# Altium schematic sheet STM32F405RGT6.SchDoc
size A4
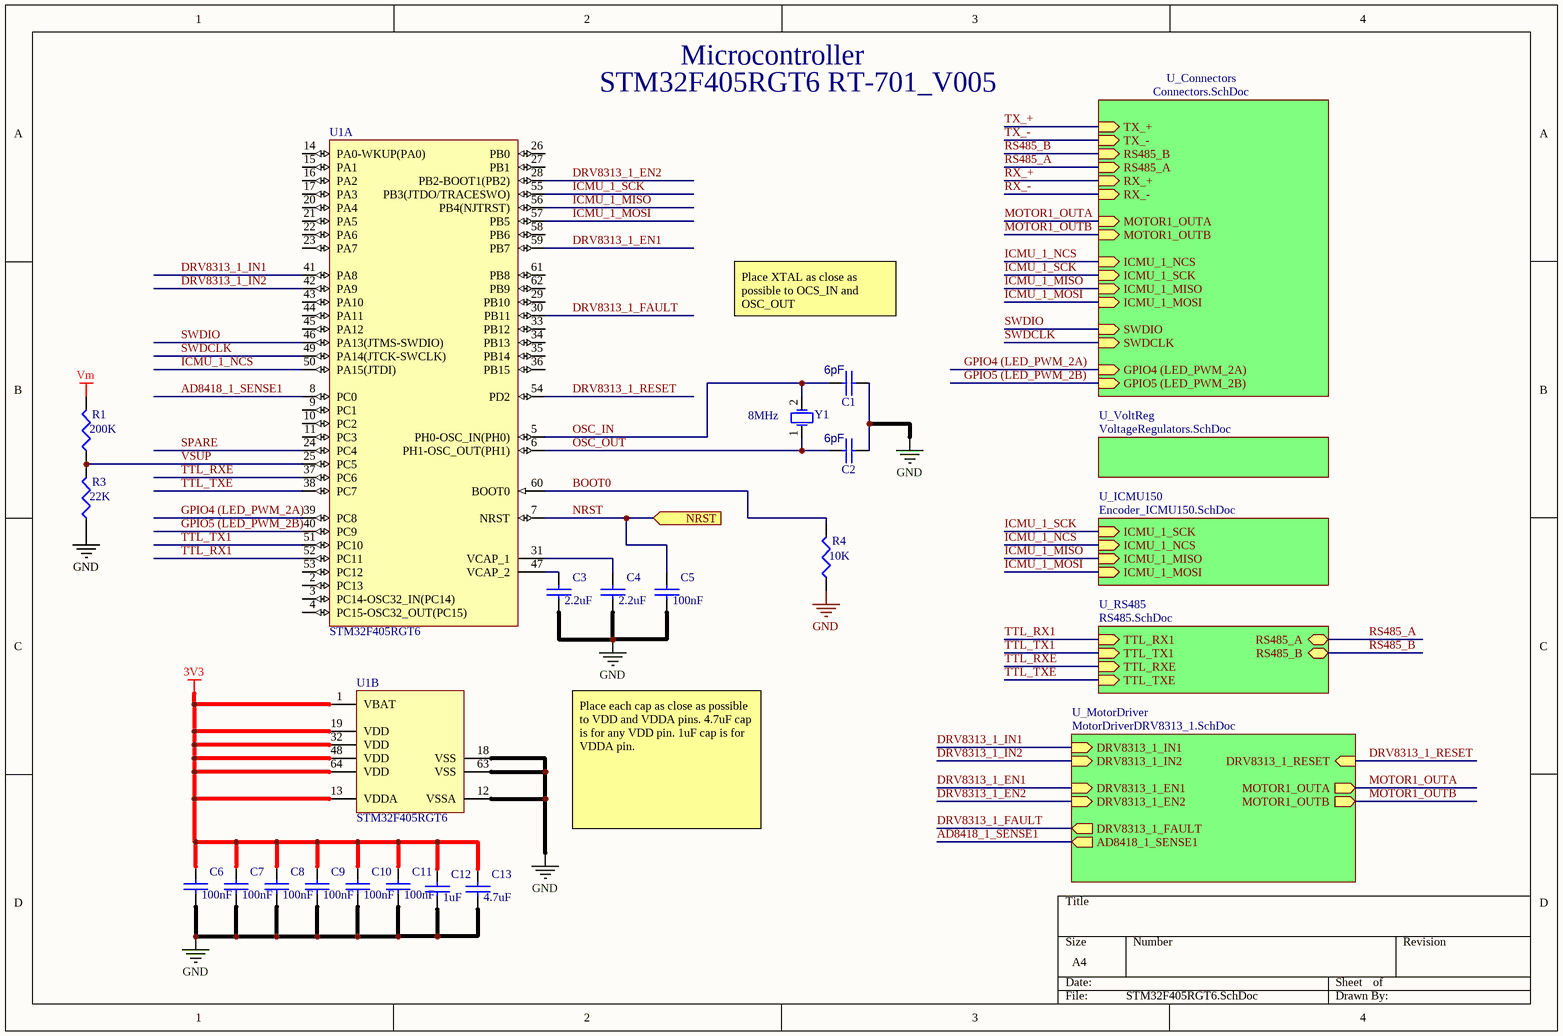
[diagram p0: STM32F405RGT6.SchDoc]

## Parts
C1  Capacitance: 6pF  [CAP0402]  (hidden comment: Capacitor)
C2  Capacitance: 6pF  [CAP0402]  (hidden comment: Capacitor)
C3  value 2.2uF  [CAP0402]  (hidden comment: Capacitor)
C4  value 2.2uF  [CAP0402]  (hidden comment: Capacitor)
C5  value 100nF  [CAP0402]  (hidden comment: Capacitor)
C6  value 100nF  [CAP0402]  (hidden comment: Capacitor)
C7  value 100nF  [CAP0402]  (hidden comment: Capacitor)
C8  value 100nF  [CAP0402]  (hidden comment: Capacitor)
C9  value 100nF  [CAP0402]  (hidden comment: Capacitor)
C10  value 100nF  [CAP0402]  (hidden comment: Capacitor)
C11  value 100nF  [CAP0402]  (hidden comment: Capacitor)
C12  value 1uF  [CAP0402]  (hidden comment: Capacitor)
C13  value 4.7uF  [CAP0402]  (hidden comment: Capacitor)
R1  value 200K  [RES0402]  (hidden comment: Res)
R3  value 22K  [RES0402]  (hidden comment: Res)
R4  value 10K  [RES0402]  (hidden comment: Res)
U1  STM32F405RGT6  [STM-LQFP64_N]  (parts A,B of 2)
Y1  value 8MHz  [2-SMD-XTAL (3.2x2.5)]  (hidden comment: Osc)

## Sub-sheets
U_Connectors = Connectors.SchDoc: TX_+ (in), RS485_B (in), RX_+ (in), MOTOR1_OUTA (in), MOTOR1_OUTB (in), TX_- (in), RS485_A (in), RX_- (in), ICMU_1_NCS (in), ICMU_1_SCK (in), ICMU_1_MISO (in), ICMU_1_MOSI (in), SWDIO (in), SWDCLK (in), GPIO4 (LED_PWM_2A) (in), GPIO5 (LED_PWM_2B) (in)
U_ICMU150 = Encoder_ICMU150.SchDoc: ICMU_1_SCK (in), ICMU_1_NCS (in), ICMU_1_MISO (in), ICMU_1_MOSI (in)
U_MotorDriver = MotorDriverDRV8313_1.SchDoc: DRV8313_1_IN1 (in), DRV8313_1_IN2 (in), DRV8313_1_EN1 (in), DRV8313_1_EN2 (in), MOTOR1_OUTA (out), MOTOR1_OUTB (out), DRV8313_1_RESET (in), DRV8313_1_FAULT (out), AD8418_1_SENSE1 (out)
U_RS485 = RS485.SchDoc: TTL_RX1 (in), TTL_TX1 (in), TTL_RXE (in), TTL_TXE (in), RS485_A (bidir), RS485_B (bidir)
U_VoltReg = VoltageRegulators.SchDoc: no entries

## Ports
NRST (in)

## Nets
3V3: C6.1 C7.1 C8.1 C9.1 C10.1 C11.1 C12.1 C13.1 U1.1(VBAT) U1.13(VDDA) U1.19(VDD) U1.32(VDD) U1.48(VDD) U1.64(VDD)
GND: C1.1 C2.1 C3.2 C4.2 C5.2 C6.2 C7.2 C8.2 C9.2 C10.2 C11.2 C12.2 C13.2 R3.1 R4.1 U1.12(VSSA) U1.18(VSS) U1.63(VSS)
Vm: R1.2
AD8418_1_SENSE1: U1.8(PC0) ; sheet U_MotorDriver/AD8418_1_SENSE1
BOOT0: R4.2 U1.60(BOOT0)
DRV8313_1_EN1: U1.59(PB7) ; sheet U_MotorDriver/DRV8313_1_EN1
DRV8313_1_EN2: U1.28(PB2-BOOT1(PB2)) ; sheet U_MotorDriver/DRV8313_1_EN2
DRV8313_1_FAULT: U1.30(PB11) ; sheet U_MotorDriver/DRV8313_1_FAULT
DRV8313_1_IN1: U1.41(PA8) ; sheet U_MotorDriver/DRV8313_1_IN1
DRV8313_1_IN2: U1.42(PA9) ; sheet U_MotorDriver/DRV8313_1_IN2
DRV8313_1_RESET: U1.54(PD2) ; sheet U_MotorDriver/DRV8313_1_RESET
GPIO4 (LED_PWM_2A): U1.39(PC8) ; sheet U_Connectors/GPIO4 (LED_PWM_2A)
GPIO5 (LED_PWM_2B): U1.40(PC9) ; sheet U_Connectors/GPIO5 (LED_PWM_2B)
ICMU_1_MISO: U1.56(PB4(NJTRST)) ; sheet U_ICMU150/ICMU_1_MISO, sheet U_Connectors/ICMU_1_MISO
ICMU_1_MOSI: U1.57(PB5) ; sheet U_ICMU150/ICMU_1_MOSI, sheet U_Connectors/ICMU_1_MOSI
ICMU_1_NCS: U1.50(PA15(JTDI)) ; sheet U_ICMU150/ICMU_1_NCS, sheet U_Connectors/ICMU_1_NCS
ICMU_1_SCK: U1.55(PB3(JTDO/TRACESWO)) ; sheet U_ICMU150/ICMU_1_SCK, sheet U_Connectors/ICMU_1_SCK
MOTOR1_OUTA: sheet U_MotorDriver/MOTOR1_OUTA, sheet U_Connectors/MOTOR1_OUTA
MOTOR1_OUTB: sheet U_MotorDriver/MOTOR1_OUTB, sheet U_Connectors/MOTOR1_OUTB
NRST: C5.1 U1.7(NRST) ; port NRST
OSC_IN: C1.2 U1.5(PH0-OSC_IN(PH0)) Y1.2
OSC_OUT: C2.2 U1.6(PH1-OSC_OUT(PH1)) Y1.1
RS485_A: sheet U_RS485/RS485_A, sheet U_Connectors/RS485_A
RS485_B: sheet U_RS485/RS485_B, sheet U_Connectors/RS485_B
RX_+: sheet U_Connectors/RX_+
RX_-: sheet U_Connectors/RX_-
SPARE: U1.24(PC4)
SWDCLK: U1.49(PA14(JTCK-SWCLK)) ; sheet U_Connectors/SWDCLK
SWDIO: U1.46(PA13(JTMS-SWDIO)) ; sheet U_Connectors/SWDIO
TTL_RX1: U1.52(PC11) ; sheet U_RS485/TTL_RX1
TTL_RXE: U1.37(PC6) ; sheet U_RS485/TTL_RXE
TTL_TX1: U1.51(PC10) ; sheet U_RS485/TTL_TX1
TTL_TXE: U1.38(PC7) ; sheet U_RS485/TTL_TXE
TX_+: sheet U_Connectors/TX_+
TX_-: sheet U_Connectors/TX_-
VSUP: R1.1 R3.2 U1.25(PC5)
NetC3_1: C3.1 U1.47(VCAP_2)
NetC4_1: C4.1 U1.31(VCAP_1)

Not connected (* = marked no-connect by the designer): U1 2(PC13) 3(PC14-OSC32_IN(PC14)) 4(PC15-OSC32_OUT(PC15)) 9(PC1) 10(PC2) 11(PC3) 14(PA0-WKUP(PA0)) 15(PA1) 16(PA2) 17(PA3) 20(PA4) 21(PA5) 22(PA6) 23(PA7) 26(PB0) 27(PB1) 29(PB10) 33(PB12) 34(PB13) 35(PB14) 36(PB15) 43(PA10) 44(PA11) 45(PA12) 53(PC12) 58(PB6) 61(PB8) 62(PB9)

## Notes on the sheet
- STM32F405RGT6 RT-701_V005
- Microcontroller
- Place XTAL as close as possible to OCS_IN and OSC_OUT
- Place each cap as close as possible to VDD and VDDA pins. 4.7uF cap is for any VDD pin. 1uF cap is for VDDA pin.

## Library data of the parts
C1 C2 = Capacitor: CAP CER 6PF 100V C0G/NP0 0402; Manufacturer 1: KEMET; Manufacturer Part Number 1: CBR04C609B1GAC; Manufacturer: *; Manufacturer Part Number: *; Supplier: *; Supplier Part Number: *; Tolerance: *; Voltage: *; Footprint: *; Temperature Coefficient: *; Supplier 1: Digi-Key; Supplier Part Number 1: 399-8610-1-ND; RoHS: Yes; Category: Ceramic Capacitors; Stock 1: 20446; Pricing 1: 1=0,34000, 10=0,23300, 50=0,15540, 100=0,13200, 500=0,09320, 1000=0,08154, 2500=0,07766, 5000=0,07184 (USD); Mount: Surface Mount; Case/Package: 0402; Case Code (Metric): 1005; Case Code (Imperial): 0402; Min Operating Temperature: -55°C; Max Operating Temperature: 125°C; Package Quantity: 1; Voltage Rating: 100V; Packaging: Tape and Reel; Voltage Rating (DC): 100V; Series: CBR; Length: 0.039inch; Width: 0.02inch; Thickness: 0.022inch; RoHS Compliant: Yes; ComponentLink1URL: https://datasheet.ciiva.com/6257/kem-c1030-cbr-smd-6257478.pdf?src-supplier=Digi-Key; ComponentLink1Description: https://datasheet.ciiva.com/6257/kem-c1030-cbr-smd-6257478.pdf?src-supplier=Digi-Key; ComponentLink2URL: https://datasheet.ciiva.com/6257/kem-c1030-cbr-smd-6257482.pdf?src-supplier=Digi-Key; ComponentLink2Description: https://datasheet.ciiva.com/6257/kem-c1030-cbr-smd-6257482.pdf?src-supplier=Digi-Key
C3 C4 = Capacitor: Manufacturer: TDK Corporation; Manufacturer Part Number: C1005X5R0J225K050BC; Tolerance: 10%; Voltage: 6.3V; Temperature Coefficient: X5R; Supplier: Digikey; Supplier Part Number: 445-6847-1-ND; Footprint: 0402; Component Type: Capacitor Ceramic
C5-C11 = Capacitor: Manufacturer: TDK Corporation; Manufacturer Part Number: CGA2B3X7R1V104K050BB; Tolerance: 10%; Voltage: 35V; Temperature Coefficient: X7R; Supplier: Digi-Key; Supplier Part Number: 445-6901-1-ND; Footprint: 0201 (0603 Metric); Component Type: Capacitor Ceramic; Price: 0.21
C12 = Capacitor: Manufacturer: TDK Corporation; Manufacturer Part Number: C1005X5R1V105K050BC; Tolerance: 10%; Voltage: 35V; Temperature Coefficient: X5R; Supplier: Digikey; Supplier Part Number: 445-9073-1-ND; Footprint: 0201 (0603 Metric); Component Type: Capacitor Ceramic
C13 = Capacitor: Manufacturer: TDK Corporation; Manufacturer Part Number: C1005X5R0J475K050BC; Tolerance: 10%; Voltage: 6.3V; Supplier: Digikey; Supplier Part Number: 445-5947-1-ND; Footprint: 0201 (0603 Metric); Component Type: Capacitor Ceramic; Price: 0.6
R1 = Resistor: Manufacturer: Yageo; Manufacturer Part Number: RC0402FR-07200KL; Power Rating: 0.063W; Tolerance: 1%; Component Type: Resistor; Price: 0.14; Supplier: Digi-Key; Supplier Part Number: 311-200KLRCT-ND; Footprint: 0201 (0603 Metric)
R3 = Resistor: Manufacturer: Yageo; Manufacturer Part Number: RC0402FR-0722KL; Power Rating: 0.063W; Tolerance: 1%; Component Type: Resistor; Price: 0.14; Supplier: Digikey; Supplier Part Number: 311-22.0KLRCT-ND
R4 = Resistor: Manufacturer: Yageo; Manufacturer Part Number: RC0402FR-0710KL; Power Rating: 0.063W; Tolerance: 1%; Component Type: Resistor; Price: 0.14; Supplier: Digi-Key; Supplier Part Number: 311-10.0KLRCT-ND; Footprint: 0201 (0603 Metric)
U1 = STM32F405RGT6: ARM Cortex-M4 32-bit MCU+FPU, 210 DMIPS, 1024 kB Flash, 192 kB Internal RAM, 51 I/Os, 64-pin LQFP, -40 to 85 degC, Tray; Manufacturer: STMicroelectronics; Component Type: ARM® Cortex®-M4 STM32 F4 Microcontroller IC 32-Bit 168MHz 1MB (1M x 8) FLASH 64-LQFP (10x10); Manufacturer Part Number: STM32F405RGT6; Price: 14.74; Supplier: Digi-Key; Supplier Part Number: 497-11767-ND
Y1 = Crystal Oscillator: Manufacturer: NDK; Manufacturer Part Number: NX3225GD-8MHZ-STD-CRA-3; Component Type: Crystal Oscillator; Price: 0.94; Supplier: Digi-Key; Supplier Part Number: 644-1178-1-ND